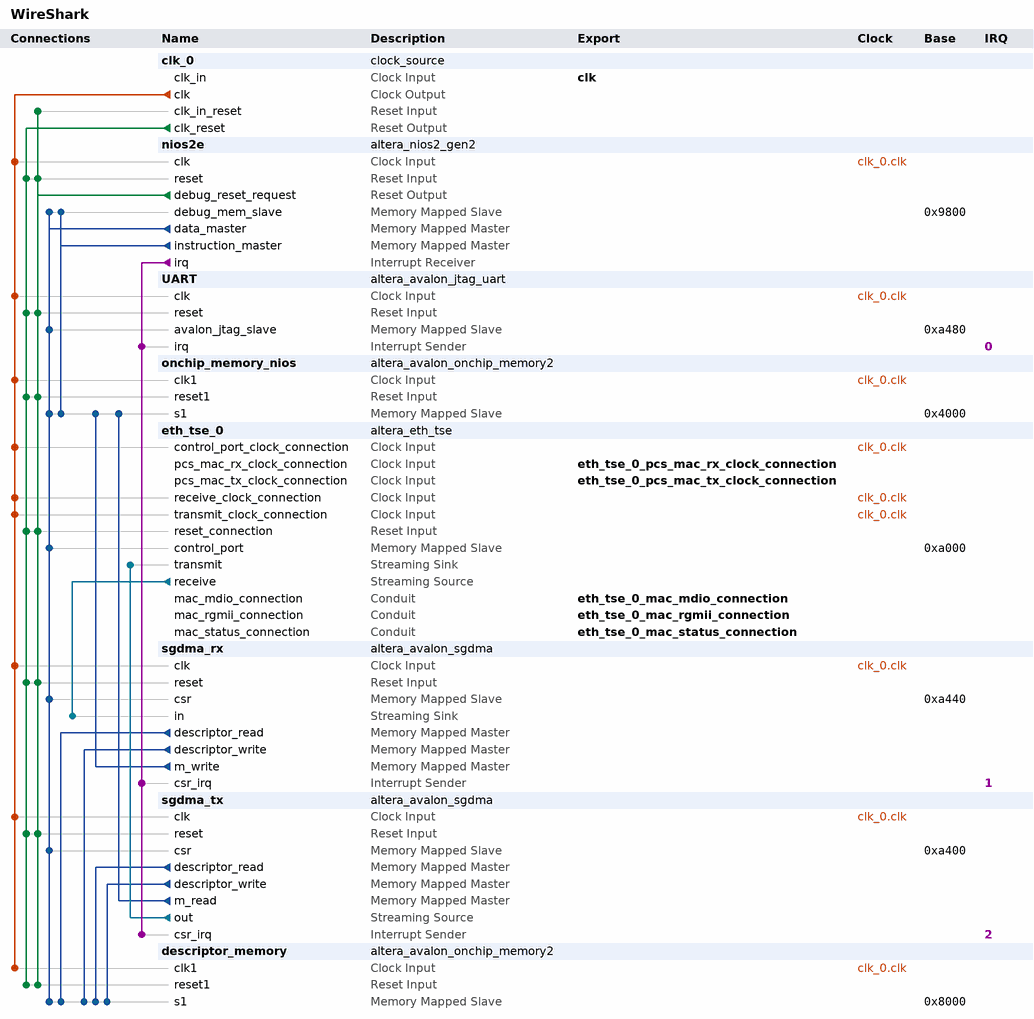
[diagram p0: system contents]
# Platform Designer (Qsys) system WireShark, Cyclone V 5CSXFC6D6F31C6
# Parameters at their usual value, and those the tool derives, are not listed.
package require -exact qsys 18.1
create_system WireShark
set_project_property DEVICE_FAMILY {Cyclone V}
set_project_property DEVICE 5CSXFC6D6F31C6

add_instance clk_0 clock_source 18.1
set_instance_parameter_value clk_0 clockFrequency 50000000

add_instance nios2e altera_nios2_gen2 18.1
set_instance_parameter_value nios2e dcache_size 2048
set_instance_parameter_value nios2e exceptionSlave onchip_memory_nios.s1
set_instance_parameter_value nios2e icache_size 4096
set_instance_parameter_value nios2e impl Tiny
set_instance_parameter_value nios2e resetSlave onchip_memory_nios.s1

add_instance UART altera_avalon_jtag_uart 18.1
set_instance_parameter_value UART simInteractiveOptions NO_INTERACTIVE_WINDOWS

add_instance onchip_memory_nios altera_avalon_onchip_memory2 18.1
set_instance_parameter_value onchip_memory_nios dataWidth 32
set_instance_parameter_value onchip_memory_nios dualPort false
set_instance_parameter_value onchip_memory_nios initMemContent false
set_instance_parameter_value onchip_memory_nios initializationFileName onchip_mem.hex
set_instance_parameter_value onchip_memory_nios memorySize 16384

add_instance eth_tse_0 altera_eth_tse 18.1
set_instance_parameter_value eth_tse_0 XCVR_RCFG_JTAG_ENABLE 0
set_instance_parameter_value eth_tse_0 XCVR_SET_CAPABILITY_REG_ENABLE 0
set_instance_parameter_value eth_tse_0 XCVR_SET_CSR_SOFT_LOGIC_ENABLE 0
set_instance_parameter_value eth_tse_0 XCVR_SET_PRBS_SOFT_LOGIC_ENABLE 0
set_instance_parameter_value eth_tse_0 XCVR_SET_USER_IDENTIFIER 0
set_instance_parameter_value eth_tse_0 core_variation MAC_ONLY
set_instance_parameter_value eth_tse_0 enable_hd_logic true
set_instance_parameter_value eth_tse_0 enable_mac_flow_ctrl false
set_instance_parameter_value eth_tse_0 enable_magic_detect true
set_instance_parameter_value eth_tse_0 enable_shift16 true
set_instance_parameter_value eth_tse_0 ifGMII RGMII
set_instance_parameter_value eth_tse_0 ing_addr 11
set_instance_parameter_value eth_tse_0 mdio_clk_div 40
set_instance_parameter_value eth_tse_0 stat_cnt_ena true
set_instance_parameter_value eth_tse_0 transceiver_type NONE

add_instance sgdma_rx altera_avalon_sgdma 18.1
set_instance_parameter_value sgdma_rx enableBurstTransfers false
set_instance_parameter_value sgdma_rx enableUnalignedTransfers false
set_instance_parameter_value sgdma_rx readBlockDataWidth 32
set_instance_parameter_value sgdma_rx sinkErrorWidth 6
set_instance_parameter_value sgdma_rx sourceErrorWidth 0
set_instance_parameter_value sgdma_rx transferMode STREAM_TO_MEMORY
set_instance_parameter_value sgdma_rx writeBurstcountWidth 4

add_instance sgdma_tx altera_avalon_sgdma 18.1
set_instance_parameter_value sgdma_tx enableBurstTransfers false
set_instance_parameter_value sgdma_tx enableUnalignedTransfers false
set_instance_parameter_value sgdma_tx readBlockDataWidth 32
set_instance_parameter_value sgdma_tx sinkErrorWidth 0
set_instance_parameter_value sgdma_tx sourceErrorWidth 1
set_instance_parameter_value sgdma_tx transferMode MEMORY_TO_STREAM
set_instance_parameter_value sgdma_tx writeBurstcountWidth 4

add_instance descriptor_memory altera_avalon_onchip_memory2 18.1
set_instance_parameter_value descriptor_memory dataWidth 32
set_instance_parameter_value descriptor_memory dualPort false
set_instance_parameter_value descriptor_memory initMemContent true
set_instance_parameter_value descriptor_memory initializationFileName onchip_mem.hex
set_instance_parameter_value descriptor_memory memorySize 4096

# connections
add_connection clk_0.clk descriptor_memory.clk1 clock
add_connection clk_0.clk eth_tse_0.control_port_clock_connection clock
add_connection clk_0.clk eth_tse_0.receive_clock_connection clock
add_connection clk_0.clk eth_tse_0.transmit_clock_connection clock
add_connection clk_0.clk nios2e.clk clock
add_connection clk_0.clk onchip_memory_nios.clk1 clock
add_connection clk_0.clk sgdma_rx.clk clock
add_connection clk_0.clk sgdma_tx.clk clock
add_connection clk_0.clk UART.clk clock
add_connection clk_0.clk_reset descriptor_memory.reset1 reset
add_connection clk_0.clk_reset eth_tse_0.reset_connection reset
add_connection clk_0.clk_reset nios2e.reset reset
add_connection clk_0.clk_reset onchip_memory_nios.reset1 reset
add_connection clk_0.clk_reset sgdma_rx.reset reset
add_connection clk_0.clk_reset sgdma_tx.reset reset
add_connection clk_0.clk_reset UART.reset reset
add_connection nios2e.debug_reset_request clk_0.clk_in_reset reset
add_connection nios2e.debug_reset_request descriptor_memory.reset1 reset
add_connection nios2e.debug_reset_request eth_tse_0.reset_connection reset
add_connection nios2e.debug_reset_request nios2e.reset reset
add_connection nios2e.debug_reset_request onchip_memory_nios.reset1 reset
add_connection nios2e.debug_reset_request sgdma_rx.reset reset
add_connection nios2e.debug_reset_request sgdma_tx.reset reset
add_connection nios2e.debug_reset_request UART.reset reset
add_connection nios2e.data_master descriptor_memory.s1 avalon
set_connection_parameter_value nios2e.data_master/descriptor_memory.s1 baseAddress 0x8000
add_connection nios2e.data_master eth_tse_0.control_port avalon
set_connection_parameter_value nios2e.data_master/eth_tse_0.control_port baseAddress 0xa000
add_connection nios2e.data_master nios2e.debug_mem_slave avalon
set_connection_parameter_value nios2e.data_master/nios2e.debug_mem_slave baseAddress 0x9800
add_connection nios2e.data_master onchip_memory_nios.s1 avalon
set_connection_parameter_value nios2e.data_master/onchip_memory_nios.s1 baseAddress 0x4000
add_connection nios2e.data_master sgdma_rx.csr avalon
set_connection_parameter_value nios2e.data_master/sgdma_rx.csr baseAddress 0xa440
add_connection nios2e.data_master sgdma_tx.csr avalon
set_connection_parameter_value nios2e.data_master/sgdma_tx.csr baseAddress 0xa400
add_connection nios2e.data_master UART.avalon_jtag_slave avalon
set_connection_parameter_value nios2e.data_master/UART.avalon_jtag_slave baseAddress 0xa480
add_connection nios2e.instruction_master nios2e.debug_mem_slave avalon
set_connection_parameter_value nios2e.instruction_master/nios2e.debug_mem_slave baseAddress 0x9800
add_connection nios2e.instruction_master onchip_memory_nios.s1 avalon
set_connection_parameter_value nios2e.instruction_master/onchip_memory_nios.s1 baseAddress 0x4000
add_connection sgdma_rx.descriptor_read descriptor_memory.s1 avalon
set_connection_parameter_value sgdma_rx.descriptor_read/descriptor_memory.s1 baseAddress 0x8000
add_connection sgdma_rx.descriptor_write descriptor_memory.s1 avalon
set_connection_parameter_value sgdma_rx.descriptor_write/descriptor_memory.s1 baseAddress 0x8000
add_connection sgdma_rx.m_write onchip_memory_nios.s1 avalon
set_connection_parameter_value sgdma_rx.m_write/onchip_memory_nios.s1 baseAddress 0x4000
add_connection sgdma_tx.descriptor_read descriptor_memory.s1 avalon
set_connection_parameter_value sgdma_tx.descriptor_read/descriptor_memory.s1 baseAddress 0x8000
add_connection sgdma_tx.descriptor_write descriptor_memory.s1 avalon
set_connection_parameter_value sgdma_tx.descriptor_write/descriptor_memory.s1 baseAddress 0x8000
add_connection sgdma_tx.m_read onchip_memory_nios.s1 avalon
set_connection_parameter_value sgdma_tx.m_read/onchip_memory_nios.s1 baseAddress 0x4000
add_connection eth_tse_0.receive sgdma_rx.in avalon_streaming
add_connection sgdma_tx.out eth_tse_0.transmit avalon_streaming
add_connection nios2e.irq sgdma_rx.csr_irq interrupt
set_connection_parameter_value nios2e.irq/sgdma_rx.csr_irq irqNumber 1
add_connection nios2e.irq sgdma_tx.csr_irq interrupt
set_connection_parameter_value nios2e.irq/sgdma_tx.csr_irq irqNumber 2
add_connection nios2e.irq UART.irq interrupt
set_connection_parameter_value nios2e.irq/UART.irq irqNumber 0

# exported interfaces
add_interface clk clock sink
set_interface_property clk EXPORT_OF clk_0.clk_in
add_interface eth_tse_0_mac_mdio_connection conduit end
set_interface_property eth_tse_0_mac_mdio_connection EXPORT_OF eth_tse_0.mac_mdio_connection
add_interface eth_tse_0_mac_rgmii_connection conduit end
set_interface_property eth_tse_0_mac_rgmii_connection EXPORT_OF eth_tse_0.mac_rgmii_connection
add_interface eth_tse_0_mac_status_connection conduit end
set_interface_property eth_tse_0_mac_status_connection EXPORT_OF eth_tse_0.mac_status_connection
add_interface eth_tse_0_pcs_mac_rx_clock_connection clock sink
set_interface_property eth_tse_0_pcs_mac_rx_clock_connection EXPORT_OF eth_tse_0.pcs_mac_rx_clock_connection
add_interface eth_tse_0_pcs_mac_tx_clock_connection clock sink
set_interface_property eth_tse_0_pcs_mac_tx_clock_connection EXPORT_OF eth_tse_0.pcs_mac_tx_clock_connection

set_interconnect_requirement {$system} qsys_mm.clockCrossingAdapter HANDSHAKE
set_interconnect_requirement {$system} qsys_mm.enableEccProtection FALSE
set_interconnect_requirement {$system} qsys_mm.insertDefaultSlave FALSE
set_interconnect_requirement {$system} qsys_mm.maxAdditionalLatency 1

save_system WireShark.qsys
